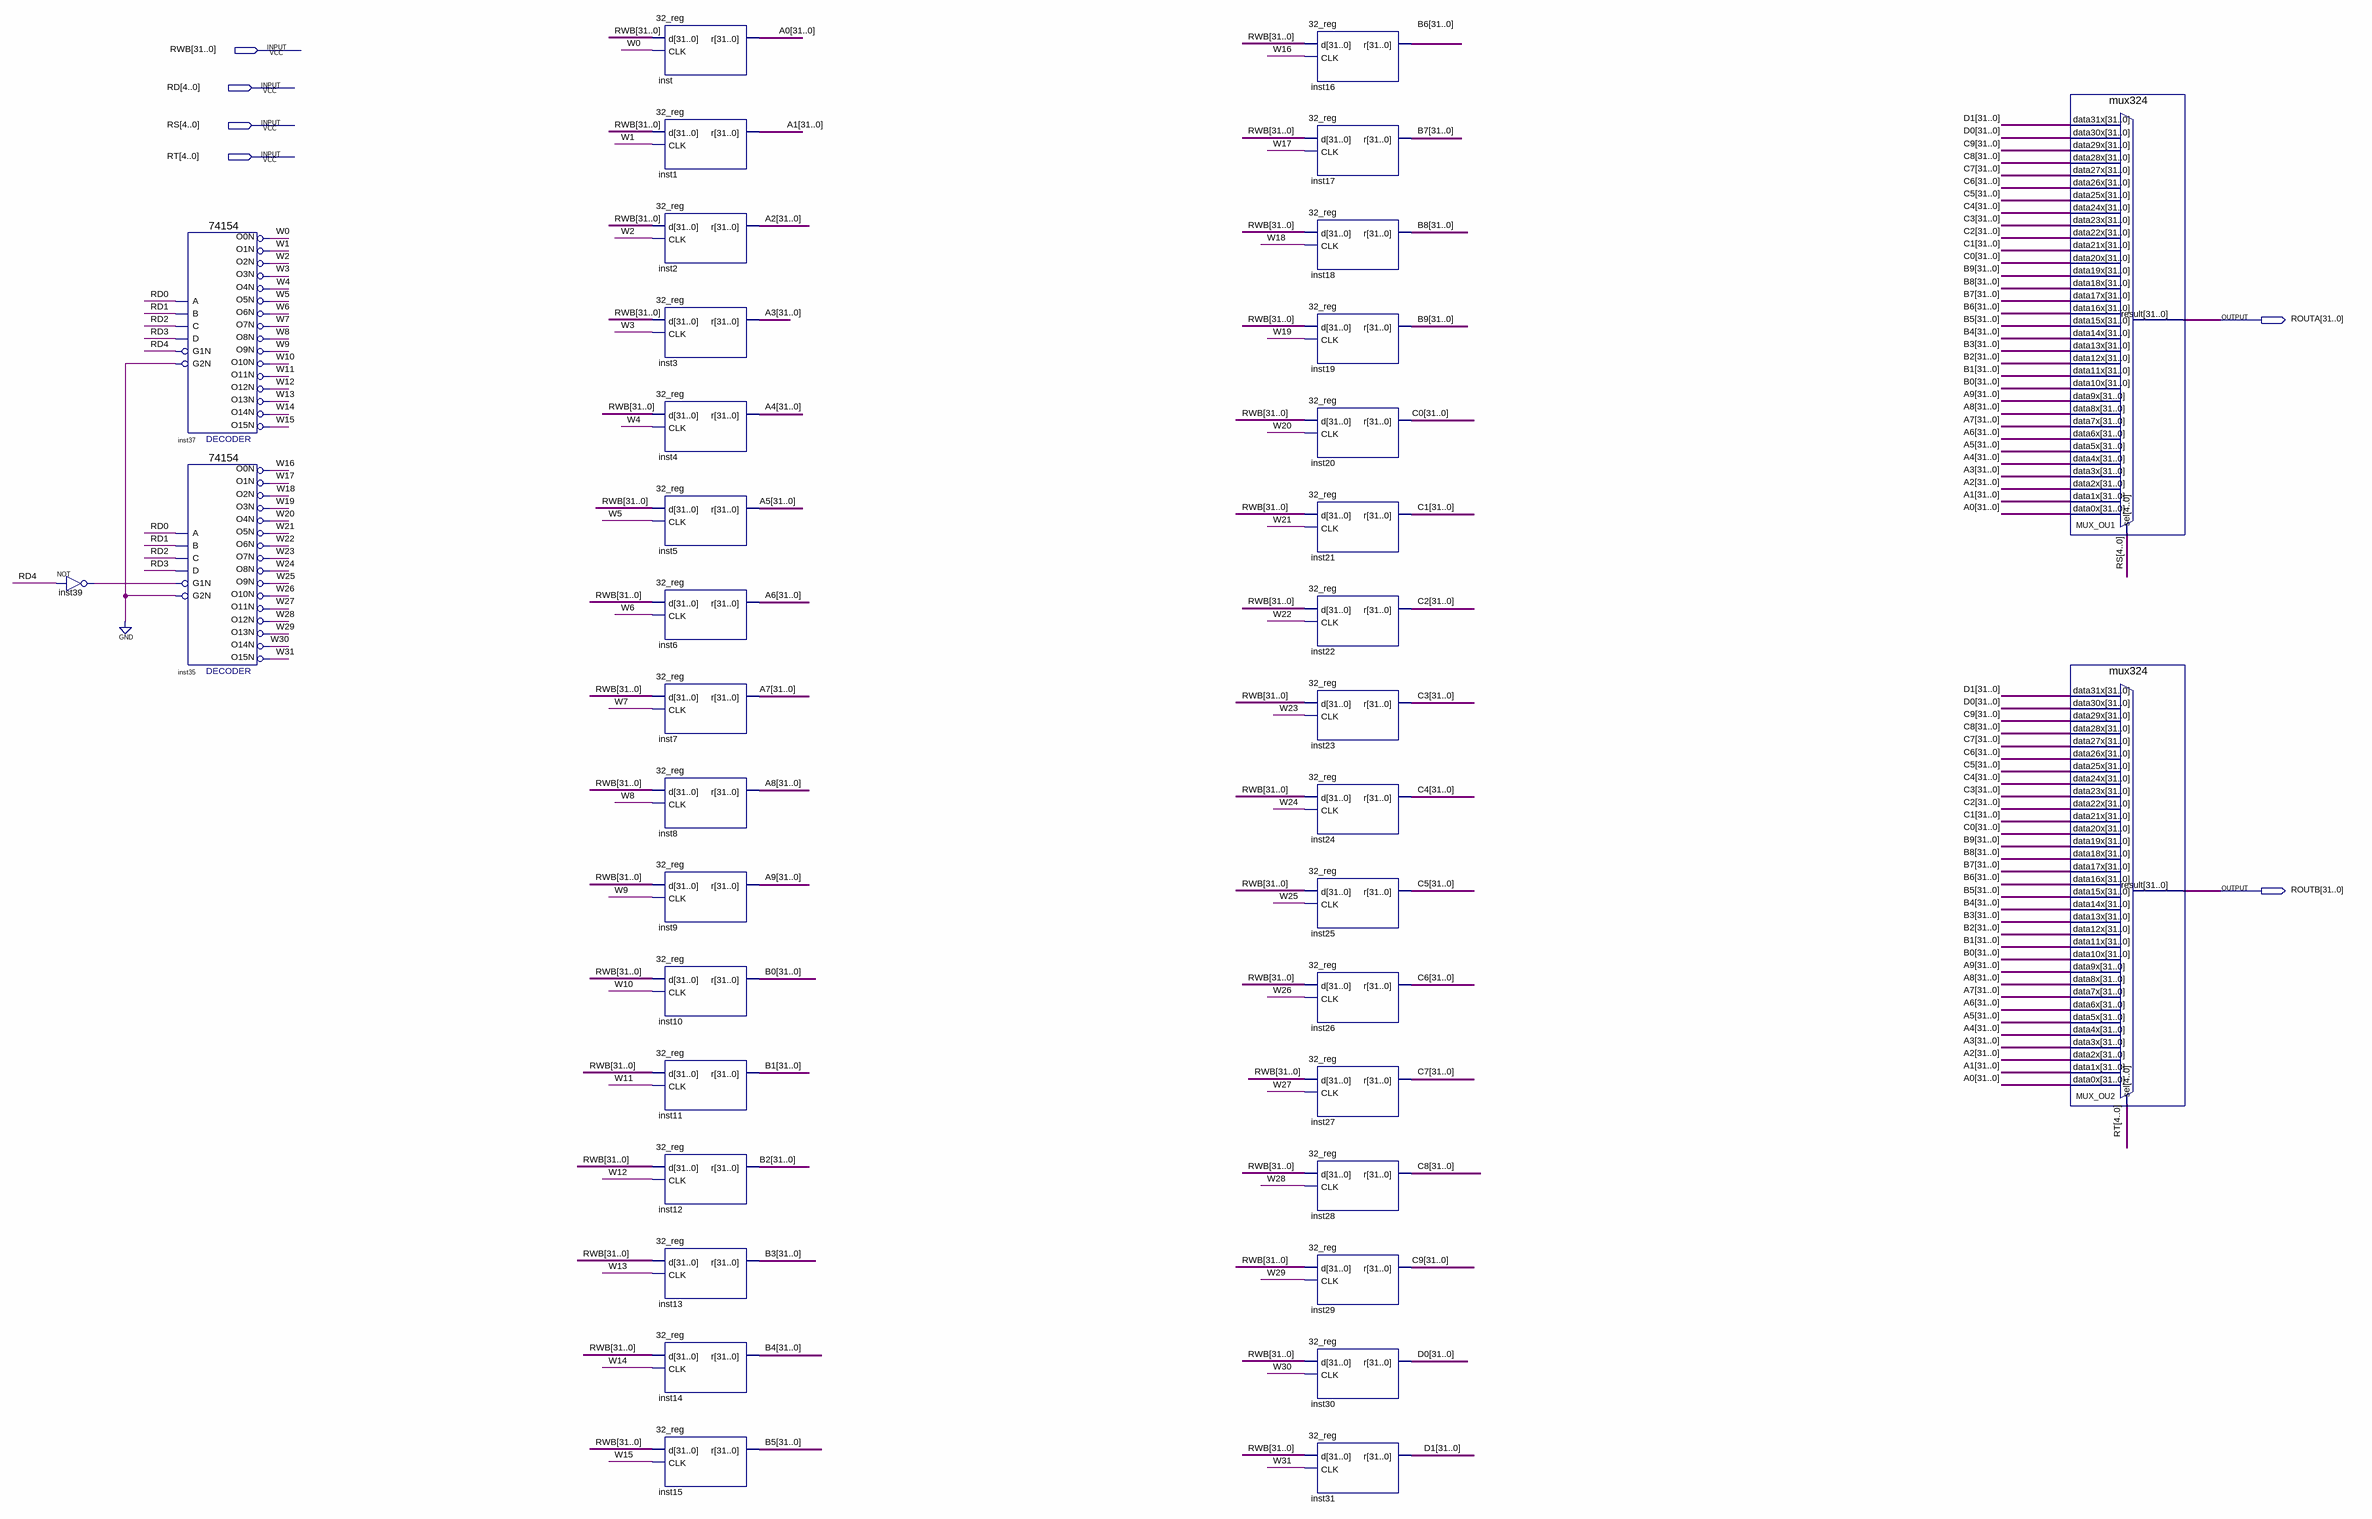
[diagram p0: schematic sheet]
// Quartus schematic Banco_Reg_32.bdf as structural Verilog: 37 symbols, 6 pins
module Banco_Reg_32 (
  input  [31:0] RWB,
  input  [4:0] RD,
  input  [4:0] RS,
  input  [4:0] RT,
  output [31:0] ROUTA,
  output [31:0] ROUTB
);

  wire inst39_out, W0, W1, W2, W3, W4, W5, W6, W7, W8, W9, W10, W11, W12, W13, W14, W15, W16, W17, W18, W19,
       W20, W21, W22, W23, W24, W25, W26, W27, W28, W29, W30, W31;
  wire [31:0] A0, A1, A2, A3, A4, A5, A6, A7, A8, A9, B0, B1, B2, B3, B4, B5, B6, B7, B8, B9, C0, C1, C2, C3,
       C4, C5, C6, C7, C8, C9, D0, D1;

  not inst39 (inst39_out, RD[4]);
  \74154  inst37 (
    .C(RD[2]), .D(RD[3]), .B(RD[1]), .A(RD[0]), .G1N(RD[4]), .G2N(1'b0), .O0N(W0), .O12N(W12), .O15N(W15),
    .O10N(W10), .O11N(W11), .O1N(W1), .O13N(W13), .O14N(W14), .O4N(W4), .O3N(W3), .O2N(W2), .O7N(W7),
    .O6N(W6), .O5N(W5), .O9N(W9), .O8N(W8));
  \74154  inst35 (
    .C(RD[2]), .D(RD[3]), .B(RD[1]), .A(RD[0]), .G1N(inst39_out), .G2N(1'b0), .O0N(W16), .O12N(W28),
    .O15N(W31), .O10N(W26), .O11N(W27), .O1N(W17), .O13N(W29), .O14N(W30), .O4N(W20), .O3N(W19), .O2N(W18),
    .O7N(W23), .O6N(W22), .O5N(W21), .O9N(W25), .O8N(W24));
  \32_reg  inst (.d(RWB), .CLK(W0), .r(A0));
  \32_reg  inst1 (.d(RWB), .CLK(W1), .r(A1));
  \32_reg  inst2 (.d(RWB), .CLK(W2), .r(A2));
  \32_reg  inst3 (.d(RWB), .CLK(W3), .r(A3));
  \32_reg  inst4 (.d(RWB), .CLK(W4), .r(A4));
  \32_reg  inst5 (.d(RWB), .CLK(W5), .r(A5));
  \32_reg  inst6 (.d(RWB), .CLK(W6), .r(A6));
  \32_reg  inst7 (.d(RWB), .CLK(W7), .r(A7));
  \32_reg  inst8 (.d(RWB), .CLK(W8), .r(A8));
  \32_reg  inst9 (.d(RWB), .CLK(W9), .r(A9));
  \32_reg  inst10 (.d(RWB), .CLK(W10), .r(B0));
  \32_reg  inst11 (.d(RWB), .CLK(W11), .r(B1));
  \32_reg  inst12 (.d(RWB), .CLK(W12), .r(B2));
  \32_reg  inst13 (.d(RWB), .CLK(W13), .r(B3));
  \32_reg  inst14 (.d(RWB), .CLK(W14), .r(B4));
  \32_reg  inst15 (.d(RWB), .CLK(W15), .r(B5));
  \32_reg  inst16 (.d(RWB), .CLK(W16), .r(B6));
  \32_reg  inst17 (.d(RWB), .CLK(W17), .r(B7));
  \32_reg  inst18 (.d(RWB), .CLK(W18), .r(B8));
  \32_reg  inst19 (.d(RWB), .CLK(W19), .r(B9));
  \32_reg  inst20 (.d(RWB), .CLK(W20), .r(C0));
  \32_reg  inst21 (.d(RWB), .CLK(W21), .r(C1));
  \32_reg  inst22 (.d(RWB), .CLK(W22), .r(C2));
  \32_reg  inst23 (.d(RWB), .CLK(W23), .r(C3));
  \32_reg  inst24 (.d(RWB), .CLK(W24), .r(C4));
  \32_reg  inst25 (.d(RWB), .CLK(W25), .r(C5));
  \32_reg  inst26 (.d(RWB), .CLK(W26), .r(C6));
  \32_reg  inst27 (.d(RWB), .CLK(W27), .r(C7));
  \32_reg  inst28 (.d(RWB), .CLK(W28), .r(C8));
  \32_reg  inst29 (.d(RWB), .CLK(W29), .r(C9));
  \32_reg  inst30 (.d(RWB), .CLK(W30), .r(D0));
  \32_reg  inst31 (.d(RWB), .CLK(W31), .r(D1));
  mux324 MUX_OU1 (
    .data31x(D1), .data30x(D0), .data29x(C9), .data28x(C8), .data27x(C7), .data26x(C6), .data25x(C5),
    .data24x(C4), .data23x(C3), .data22x(C2), .data21x(C1), .data20x(C0), .data19x(B9), .data18x(B8),
    .data17x(B7), .data16x(B6), .data15x(B5), .data14x(B4), .data13x(B3), .data12x(B2), .data11x(B1),
    .data10x(B0), .data9x(A9), .data8x(A8), .data7x(A7), .data6x(A6), .data5x(A5), .data4x(A4), .data3x(A3),
    .data2x(A2), .data1x(A1), .data0x(A0), .sel(RS), .result(ROUTA));
  mux324 MUX_OU2 (
    .data31x(D1), .data30x(D0), .data29x(C9), .data28x(C8), .data27x(C7), .data26x(C6), .data25x(C5),
    .data24x(C4), .data23x(C3), .data22x(C2), .data21x(C1), .data20x(C0), .data19x(B9), .data18x(B8),
    .data17x(B7), .data16x(B6), .data15x(B5), .data14x(B4), .data13x(B3), .data12x(B2), .data11x(B1),
    .data10x(B0), .data9x(A9), .data8x(A8), .data7x(A7), .data6x(A6), .data5x(A5), .data4x(A4), .data3x(A3),
    .data2x(A2), .data1x(A1), .data0x(A0), .sel(RT), .result(ROUTB));
endmodule
